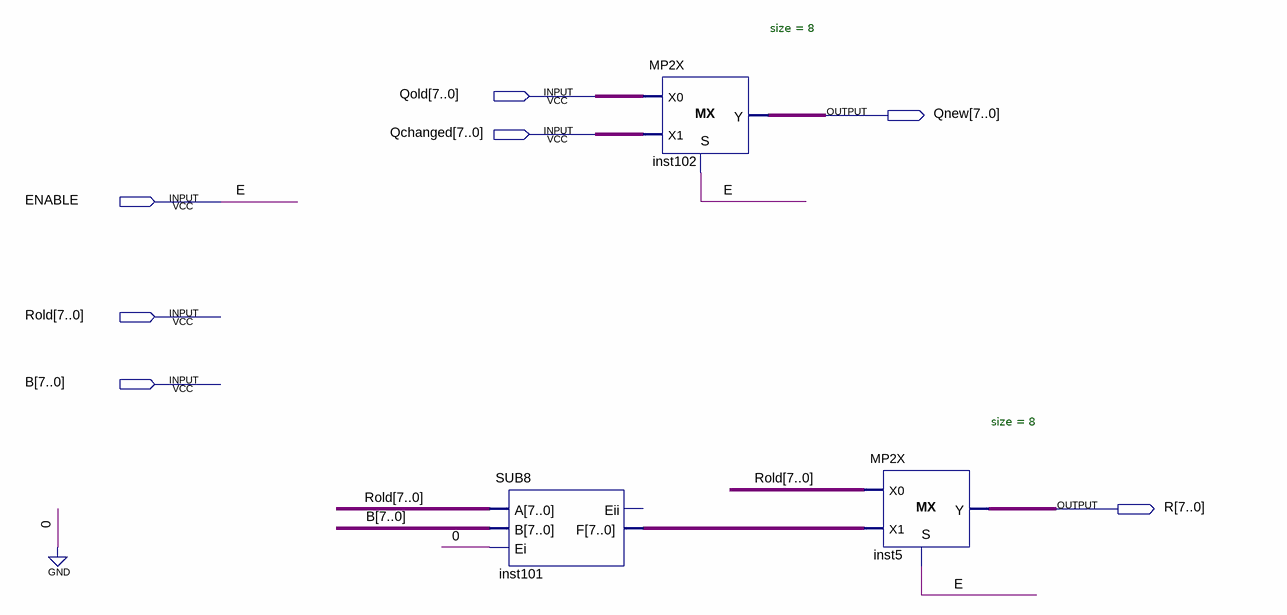
[diagram p0: schematic sheet]
// Quartus schematic CHANGER8.bdf as structural Verilog: 3 symbols, 7 pins
module CHANGER8 (
  input  [7:0] Qold,
  input  [7:0] Qchanged,
  input  ENABLE,
  input  [7:0] Rold,
  input  [7:0] B,
  output [7:0] Qnew,
  output [7:0] R
);

  wire [7:0] inst101_f;

  SUB8 inst101 (.A(Rold), .B(B), .Ei(1'b0), .F(inst101_f));  // open: Eii
  MP2X #(.size(8)) inst102 (.S(ENABLE), .X0(Qold), .X1(Qchanged), .Y(Qnew));
  MP2X #(.size(8)) inst5 (.S(ENABLE), .X0(Rold), .X1(inst101_f), .Y(R));

  // Other names for the same wires on the sheet: E = ENABLE
endmodule
